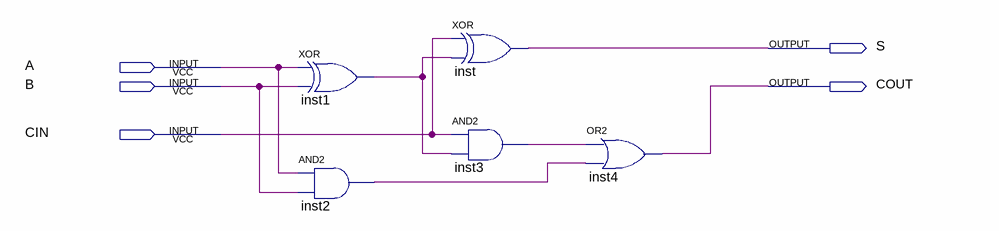
[diagram p0: schematic sheet]
// Quartus schematic FA.bdf as structural Verilog: 5 symbols, 5 pins
module FA (
  input  A,
  input  B,
  input  CIN,
  output S,
  output COUT
);

  wire inst1_out, inst2_out, inst3_out;

  xor inst1 (inst1_out, A, B);
  and inst2 (inst2_out, A, B);
  xor inst (S, CIN, inst1_out);
  and inst3 (inst3_out, CIN, inst1_out);
  or inst4 (COUT, inst3_out, inst2_out);
endmodule
